# Altium project Transponder.PrjPcb
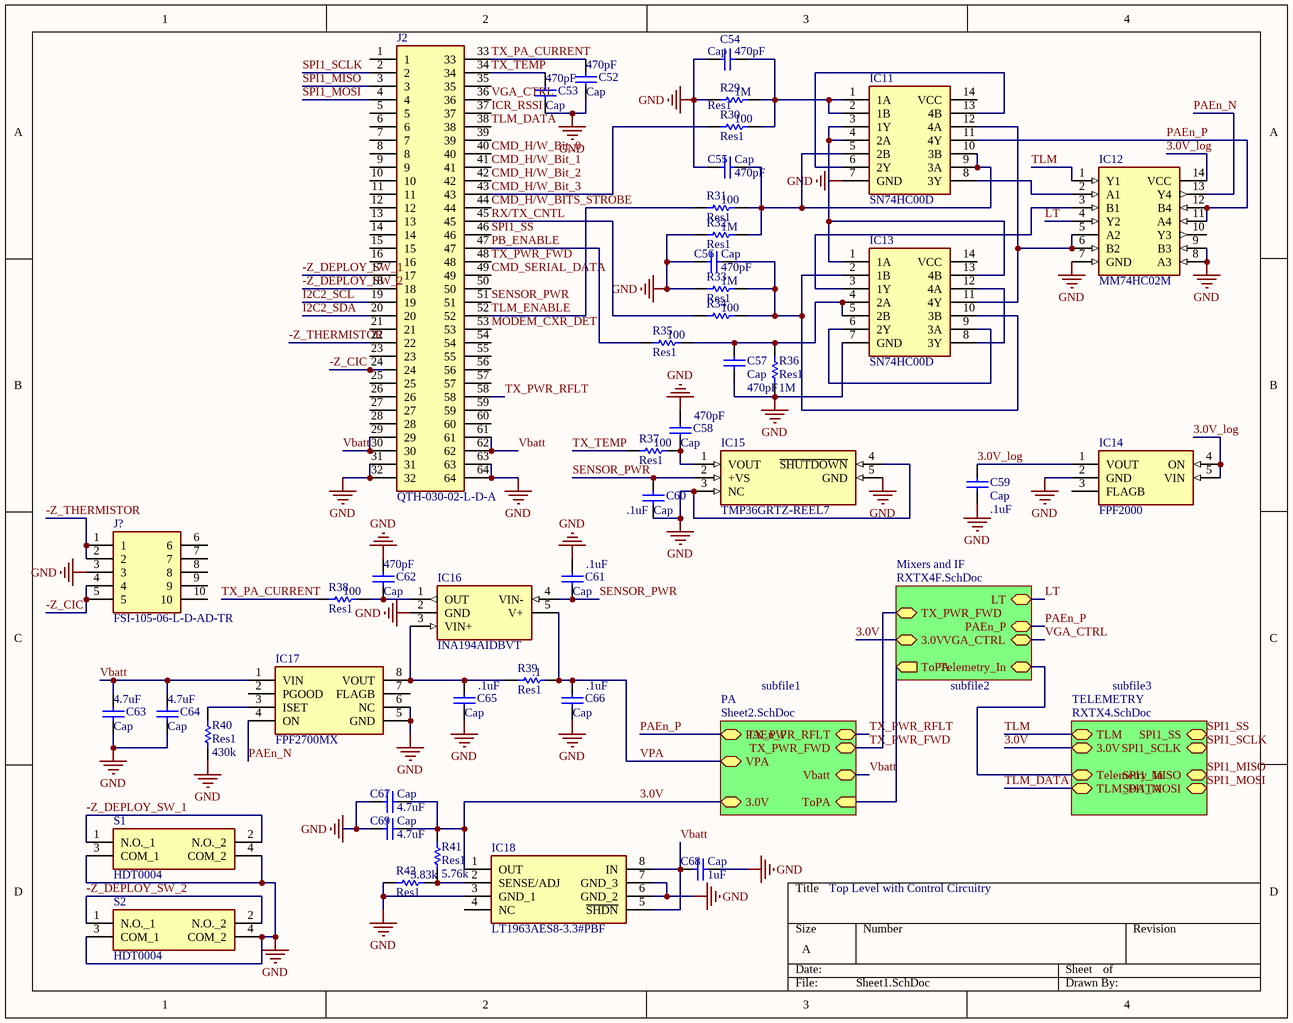
[diagram p0: Sheet1.SchDoc]
4 sheets, 303 parts. Net scope: hierarchical (ports join the sheet entries above them; power ports are global).
Board file: PCB1.PcbDoc
Sheets:
  Sheet1.SchDoc
    PA = Sheet2.SchDoc
    Mixers and IF = RXTX4F.SchDoc
    TELEMETRY = RXTX4.SchDoc

## Sheet Sheet1.SchDoc
size A

### Parts
C52  Cap  value 470pF  [0603]
C53  Cap  value 470pF  [0603]
C54  Cap  value 470pF  [0603]
C55  Cap  value 470pF  [0603]
C56  Cap  value 470pF  [0603]
C57  Cap  value 470pF  [0603]
C58  Cap  value 470pF  [0603]
C59  Cap  value .1uF  [0603]
C60  Cap  value .1uF  [0603]
C61  Cap  value .1uF  [0603]
C62  Cap  value 470pF  [0603]
C63  Cap  value 4.7uF  [0603]
C64  Cap  value 4.7uF  [0603]
C65  Cap  value .1uF  [0603]
C66  Cap  value .1uF  [0603]
C67  Cap  value 4.7uF  [0603]
C68  Cap  value 1uF  [0603]
C69  Cap  value 4.7uF  [0603]
IC11  SN74HC00D  [SOIC127P600X175-14N]
IC12  MM74HC02M  [SOIC127P600X175-14N]
IC13  SN74HC00D  [SOIC127P600X175-14N]
IC14  FPF2000  [SOT65P210X110-5N]
IC15  TMP36GRTZ-REEL7  [SOT95P280X145-5N]
IC16  INA194AIDBVT  [SOT95P280X145-5N]
IC17  FPF2700MX  [SOIC127P600X175-8N]
IC18  LT1963AES8-3.3#PBF  [SOIC127P599X175-8N]
J2  QTH-030-02-L-D-A  [QTH03002LDA]
J?  FSI-105-06-L-D-AD-TR  [FSI10506LDADTR]
R29  Res1  value 1M  [0603]
R30  Res1  value 100  [0603]
R31  Res1  value 100  [0603]
R32  Res1  value 1M  [0603]
R33  Res1  value 1M  [0603]
R34  value 100  [0603]  (hidden comment: Res1)
R35  Res1  value 100  [0603]
R36  Res1  value 1M  [0603]
R37  Res1  value 100  [0603]
R38  Res1  value 100  [0603]
R39  Res1  value .1  [0603]
R40  Res1  value 430k  [0603]
R41  Res1  value 5.76k  [0603]
R42  Res1  value 3.83k  [0603]
S1  HDT0004  [HDT0004]
S2  HDT0004  [HDT0004]

### Sub-sheets
Mixers and IF = RXTX4F.SchDoc: TX_PWR_FWD (bidir), 3.0V (bidir), ToPA (out), LT (bidir), PAEn_P (bidir), VGA_CTRL (bidir), Telemetry_In (bidir)
PA = Sheet2.SchDoc: PAEn_P (bidir), VPA (bidir), 3.0V (bidir), TX_PWR_RFLT (bidir), TX_PWR_FWD (bidir), Vbatt (bidir), ToPA (in)
TELEMETRY = RXTX4.SchDoc: TLM (bidir), 3.0V (bidir), Telemetry_In (bidir), TLM_DATA (bidir), SPI1_SS (bidir), SPI1_SCLK (bidir), SPI1_MISO (bidir), SPI1_MOSI (bidir)

### Nets
GND: C52.2 C53.2 C54.1 C55.1 C56.1 C57.2 C58.1 C59.2 C60.2 C61.1 C62.1 C63.2 C64.2 C65.2 C66.2 C67.1 C68.2 C69.1 IC11.7(GND) IC12.7(GND) IC12.8(A3) IC12.9(B3) IC13.7(GND) IC14.2(GND) IC15.3(NC) IC15.4(~{SHUTDOWN}) IC15.5(GND) IC16.2(GND) IC17.5(GND) IC17.6(NC) IC18.3(GND_1) IC18.6(GND_2) IC18.7(GND_3) J2.31 J2.32 J2.63 J2.64 J?.3 R29.1 R32.1 R33.1 R36.2 R40.2 R42.1 S1.3(COM_1) S1.4(COM_2) S2.3(COM_1) S2.4(COM_2)
3.0V: C67.2 C69.2 IC18.1(OUT) R41.1 ; sheet PA/3.0V, sheet Mixers and IF/3.0V, sheet TELEMETRY/3.0V
3.0V_log: C59.1 IC12.14(VCC) IC14.1(VOUT) IC14.4(ON) IC14.5(VIN)
-Z_CIC: J2.24 J?.4 J?.5
-Z_DEPLOY_SW_1: J2.17 S1.1(N.O._1) S1.2(N.O._2)
-Z_DEPLOY_SW_2: J2.18 S2.1(N.O._1) S2.2(N.O._2)
-Z_THERMISTOR: J2.22 J?.1 J?.2
CMD_H/W_Bit_0: J2.40
CMD_H/W_Bit_1: J2.41
CMD_H/W_Bit_2: J2.42
CMD_H/W_Bit_3: J2.43 R30.1
CMD_H/W_BITS_STROBE: J2.44
CMD_SERIAL_DATA: J2.49
I2C2_SCL: J2.19
I2C2_SDA: J2.20
ICR_RSSI: J2.37
LT: IC12.4(Y2) ; sheet Mixers and IF/LT
MODEM_CXR_DET: J2.53
PAEn_N: IC12.13(Y4) IC17.4(ON)
PAEn_P: IC11.11(4Y) IC12.11(A4) IC12.12(B4) ; sheet PA/PAEn_P, sheet Mixers and IF/PAEn_P
PB_ENABLE: J2.47 R35.1
RX/TX_CNTL: J2.45 R34.1
SENSOR_PWR: C60.1 C61.2 IC15.2(+VS) IC16.4(VIN-) J2.51
SPI1_MISO: J2.3 ; sheet TELEMETRY/SPI1_MISO
SPI1_MOSI: J2.4 ; sheet TELEMETRY/SPI1_MOSI
SPI1_SCLK: J2.2 ; sheet TELEMETRY/SPI1_SCLK
SPI1_SS: J2.46 ; sheet TELEMETRY/SPI1_SS
TLM: IC12.1(Y1) ; sheet TELEMETRY/TLM
TLM_DATA: J2.38 ; sheet TELEMETRY/TLM_DATA
TLM_ENABLE: J2.52 R31.1
TX_PA_CURRENT: C52.1 J2.33 R38.1
TX_PWR_FWD: J2.48 ; sheet PA/TX_PWR_FWD, sheet Mixers and IF/TX_PWR_FWD
TX_PWR_RFLT: J2.58 ; sheet PA/TX_PWR_RFLT
TX_TEMP: C53.1 J2.34 R37.1
Vbatt: C63.1 C64.1 C68.1 IC17.1(VIN) IC18.5(~{SHDN}) IC18.8(IN) J2.29 J2.30 J2.61 J2.62 ; sheet PA/Vbatt
VGA_CTRL: J2.36 ; sheet Mixers and IF/VGA_CTRL
VPA: C66.1 IC16.5(V+) R39.2 ; sheet PA/VPA
NetC32_2: sheet PA/ToPA, sheet Mixers and IF/ToPA
NetC54_2: C54.2 IC11.1(1A) IC11.2(1B) R29.2 R30.2
NetC55_2: C55.2 IC11.5(2B) IC11.9(3A) IC11.10(3B) R31.2 R32.2
NetC56_2: C56.2 IC13.2(1B) IC13.10(3B) R33.2 R34.2
NetC57_1: C57.1 IC13.4(2A) IC13.5(2B) R35.2 R36.1
NetC58_2: C58.2 IC15.1(VOUT) R37.2
NetC62_2: C62.2 IC16.1(OUT) R38.2
NetC65_1: C65.1 IC16.3(VIN+) IC17.8(VOUT) R39.1
NetC212_2: sheet Mixers and IF/Telemetry_In, sheet TELEMETRY/Telemetry_In
NetIC11_3: IC11.3(1Y) IC11.4(2A) IC13.1(1A) IC13.13(4B)
NetIC11_6: IC11.6(2Y) IC11.13(4B)
NetIC11_8: IC11.8(3Y) IC12.2(A1)
NetIC11_12: IC11.12(4A) IC12.5(A2) IC12.6(B2) IC13.11(4Y)
NetIC12_3: IC12.3(B1) IC13.3(1Y)
NetIC13_6: IC13.6(2Y) IC13.9(3A)
NetIC13_8: IC13.8(3Y) IC13.12(4A)
NetIC17_3: IC17.3(ISET) R40.1
NetIC18_2: IC18.2(SENSE/ADJ) R41.2 R42.2

Not connected (* = marked no-connect by the designer): IC11 14(VCC); IC12 10(Y3); IC13 14(VCC); IC14 3(FLAGB); IC17 2(PGOOD) 7(FLAGB); IC18 4(NC); J2 1 5 6 7 8 9 10 11 12 13 14 15 16 21 23 25 26 27 28 35 39 50 54 55 56 57 59 60; J? 6 7 8 9 10

### Notes on the sheet
- subfile1
- subfile2
- subfile3
- Top Level with Control Circuitry

### Library data of the parts
C52-C69 = Cap: Capacitor; Published: 8-Jun-2000; LatestRevisionDate: 17-Jul-2002; LatestRevisionNote: Re-released for DXP Platform.; PackageReference: RAD-0.3; Publisher: Altium Limited; PackageDescription: Radial Cap, Thru-Hole; 2 Leads; 0.3 in Pin Spacing
IC11 IC13 = SN74HC00D: Integrated Circuit; Manufacturer_Name: Texas Instruments; Datasheet Link: http://www.ti.com/lit/gpn/sn74hc00; Height: 1.75mm; Manufacturer_Part_Number: SN74HC00D; Mouser Part Number: 595-SN74HC00D; Mouser Price/Stock: https://www.mouser.com/Search/Refine.aspx?Keyword=595-SN74HC00D; RS Part Number: 0526234; RS Price/Stock: http://uk.rs-online.com/web/p/products/0526234
IC12 = MM74HC02M: Integrated Circuit; Manufacturer_Name: ON Semiconductor; Datasheet Link: https://www.fairchildsemi.com/datasheets/MM/MM74HC02.pdf; Height: 1.75mm; Manufacturer_Part_Number: MM74HC02M; Mouser Part Number: 512-MM74HC02M; Mouser Price/Stock: https://www.mouser.com/Search/Refine.aspx?Keyword=512-MM74HC02M; RS Part Number: 7613555P; RS Price/Stock: http://uk.rs-online.com/web/p/products/7613555P
IC14 = FPF2000: Integrated Circuit; Manufacturer_Name: ON Semiconductor; Datasheet Link: https://www.onsemi.com/pub/Collateral/FPF2001-D.pdf; Height: 1.1mm; Manufacturer_Part_Number: FPF2000; Mouser Part Number: 512-FPF2000; Mouser Price/Stock: https://www.mouser.com/Search/Refine.aspx?Keyword=512-FPF2000; RS Part Number: 6709942P; RS Price/Stock: http://uk.rs-online.com/web/p/products/6709942P
IC15 = TMP36GRTZ-REEL7: Integrated Circuit; Manufacturer_Name: Analog Devices; Datasheet Link: http://componentsearchengine.com/Datasheets/3/TMP36GRTZ-REEL7.pdf; Height: 1.45mm; Manufacturer_Part_Number: TMP36GRTZ-REEL7; Mouser Part Number: 584-TMP36GRTZ-R7; Mouser Price/Stock: https://www.mouser.com/Search/Refine.aspx?Keyword=584-TMP36GRTZ-R7; RS Part Number: 8099367P; RS Price/Stock: http://uk.rs-online.com/web/p/products/8099367P
IC16 = INA194AIDBVT: Integrated Circuit; Manufacturer_Name: Texas Instruments; Datasheet Link: http://www.ti.com/lit/ds/symlink/ina194.pdf; Height: 1.45mm; Manufacturer_Part_Number: INA194AIDBVT; Mouser Part Number: 595-INA194AIDBVT; Mouser Price/Stock: https://www.mouser.com/Search/Refine.aspx?Keyword=595-INA194AIDBVT; RS Part Number: 5457625P; RS Price/Stock: http://uk.rs-online.com/web/p/products/5457625P
IC17 = FPF2700MX: Integrated Circuit; Manufacturer_Name: ON Semiconductor; Datasheet Link: https://www.onsemi.com/pub/Collateral/FPF2702-D.pdf; Height: 1.75mm; Manufacturer_Part_Number: FPF2700MX; Mouser Part Number: 512-FPF2700MX; Mouser Price/Stock: https://www.mouser.com/Search/Refine.aspx?Keyword=512-FPF2700MX; RS Part Number: 8088966P; RS Price/Stock: http://uk.rs-online.com/web/p/products/8088966P
IC18 = LT1963AES8-3.3#PBF: Integrated Circuit; Manufacturer_Name: Linear Technology; Datasheet Link: http://www.linear.com/docs/3709; Height: 1.752mm; Manufacturer_Part_Number: LT1963AES8-3.3#PBF; Mouser Part Number: 584-1963AES8-3.3PBF; Mouser Price/Stock: https://www.mouser.com/Search/Refine.aspx?Keyword=584-1963AES8-3.3PBF; RS Part Number: 7618550P; RS Price/Stock: http://uk.rs-online.com/web/p/products/7618550P
J2 = QTH-030-02-L-D-A: Connector; Manufacturer_Name: SAMTEC; Datasheet Link: http://suddendocs.samtec.com/prints/qth-xxx-xx-x-d-xxx-mkt.pdf; Height: 7.064mm; Manufacturer_Part_Number: QTH-030-02-L-D-A; Mouser Part Number: 200-QTH03002LDA; Mouser Price/Stock: https://www.mouser.com/Search/Refine.aspx?Keyword=200-QTH03002LDA; RS Part Number: 7678748P; RS Price/Stock: http://uk.rs-online.com/web/p/products/7678748P
J? = FSI-105-06-L-D-AD-TR: Connector; Manufacturer_Name: SAMTEC; Datasheet Link: http://suddendocs.samtec.com/prints/fsi-1xx-xx-xxx-d-x-xx-xx-mkt.pdf; Height: 7.4mm; Manufacturer_Part_Number: FSI-105-06-L-D-AD-TR
R29-R42 = Res1: Resistor; Published: 8-Jun-2000; LatestRevisionDate: 17-Jul-2002; LatestRevisionNote: Re-released for DXP Platform.; PackageReference: AXIAL-0.3; Publisher: Altium Limited; PackageDescription: Axial Device, Thru-Hole; 2 Leads; 0.3 in Pin Spacing
S1 S2 = HDT0004: Switch; Manufacturer_Name: C & K COMPONENTS; Datasheet Link: https://www.ckswitches.com/media/1307/hdt.pdf; Height: 3mm; Manufacturer_Part_Number: HDT0004; Mouser Part Number: 611-HDT0004; Mouser Price/Stock: https://www.mouser.com/Search/Refine.aspx?Keyword=611-HDT0004; RS Part Number: 7931608P; RS Price/Stock: http://uk.rs-online.com/web/p/products/7931608P

## Sheet Sheet2.SchDoc
size A
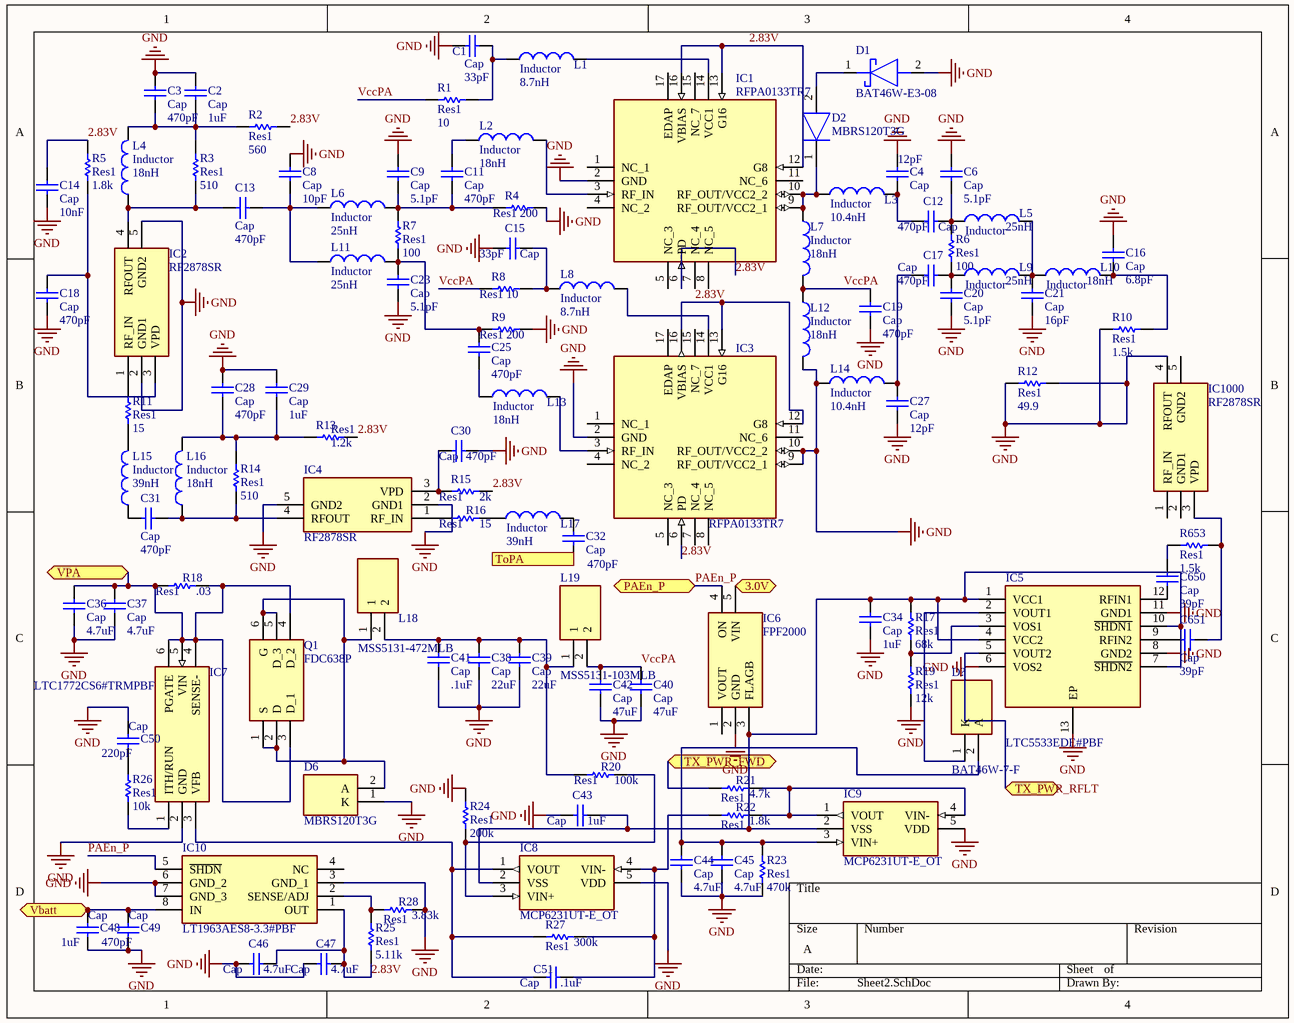
[diagram p1: Sheet2.SchDoc]

### Parts
C1  Cap  value 33pF  [0603]
C2  Cap  value 1uF  [0603]
C3  Cap  value 470pF  [0603]
C4  Cap  value 12pF  [0603]
C6  Cap  value 5.1pF  [0603]
C8  Cap  value 10pF  [0603]
C9  Cap  value 5.1pF  [0603]
C11  Cap  value 470pF  [0603]
C12  Cap  value 470pF  [0603]
C13  Cap  value 470pF  [0603]
C14  Cap  value 10nF  [0603]
C15  Cap  value 33pF  [0603]
C16  Cap  value 6.8pF  [0603]
C17  Cap  value 470pF  [0603]
C18  Cap  value 470pF  [0603]
C19  Cap  value 470pF  [0603]
C20  Cap  value 5.1pF  [0603]
C21  Cap  value 16pF  [0603]
C23  Cap  value 5.1pF  [0603]
C25  Cap  value 470pF  [0603]
C27  Cap  value 12pF  [0603]
C28  Cap  value 470pF  [0603]
C29  Cap  value 1uF  [0603]
C30  Cap  value 470pF  [0603]
C31  Cap  value 470pF  [0603]
C32  Cap  value 470pF  [0603]
C34  Cap  value 1uF  [0603]
C36  Cap  value 4.7uF  [0603]
C37  Cap  value 4.7uF  [0603]
C38  Cap  value 22uF  [0603]
C39  Cap  value 22uF  [0603]
C40  Cap  value 47uF  [0603]
C41  Cap  value .1uF  [0603]
C42  Cap  value 47uF  [0603]
C43  Cap  value 1uF  [0603]
C44  Cap  value 4.7uF  [0603]
C45  Cap  value 4.7uF  [0603]
C46  Cap  value 4.7uF  [0603]
C47  Cap  value 4.7uF  [0603]
C48  Cap  value 1uF  [0603]
C49  Cap  value 470pF  [0603]
C50  Cap  value 220pF  [0603]
C51  Cap  value .1uF  [0603]
C650  Cap  value 39pF  [0603]
C651  Cap  value 39pF  [0603]
D1  BAT46W-E3-08  [SOD3716X135N]
D2  MBRS120T3G  [DIOM5436X247N]
D6  MBRS120T3G  [DIOM5436X247N]
D?  BAT46W-7-F  [SOD3716X145N]
IC1  RFPA0133TR7  [QFN50P300X300X86-17N-D]
IC2  RF2878SR  [SOT95P280X159-5N]
IC3  RFPA0133TR7  [QFN50P300X300X86-17N-D]
IC4  RF2878SR  [SOT95P280X159-5N]
IC5  LTC5533EDE#PBF  [SON50P300X400X85-13N-D]
IC6  FPF2000  [SOT65P210X110-5N]
IC7  LTC1772CS6#TRMPBF  [SOT95P280X100-6N]
IC8  MCP6231UT-E_OT  [SOT95P270X145-5N]
IC9  MCP6231UT-E_OT  [SOT95P270X145-5N]
IC10  LT1963AES8-3.3#PBF  [SOIC127P599X175-8N]
IC1000  RF2878SR  [SOT95P280X159-5N]
L1  Inductor  value 8.7nH  [0603]
L2  Inductor  value 18nH  [0603]
L3  Inductor  value 10.4nH  [0603]
L4  Inductor  value 18nH  [0603]
L5  Inductor  value 25nH  [0603]
L6  Inductor  value 25nH  [0603]
L7  Inductor  value 18nH  [0603]
L8  Inductor  value 8.7nH  [0603]
L9  Inductor  value 25nH  [0603]
L10  Inductor  value 18nH  [0603]
L11  Inductor  value 25nH  [0603]
L12  Inductor  value 18nH  [0603]
L13  Inductor  value 18nH  [0603]
L14  Inductor  value 10.4nH  [0603]
L15  Inductor  value 39nH  [0603]
L16  Inductor  value 18nH  [0603]
L17  Inductor  value 39nH  [0603]
L18  MSS5131-472MLB  [MSS5131]
L19  MSS5131-103MLB  [MSS5131]
Q1  FDC638P  [SOT95P280X110-6N]
R1  Res1  value 10  [0603]
R2  Res1  value 560  [0603]
R3  Res1  value 510  [0603]
R4  Res1  value 200  [0603]
R5  Res1  value 1.8k  [0603]
R6  Res1  value 100  [0603]
R7  Res1  value 100  [0603]
R8  Res1  value 10  [0603]
R9  Res1  value 200  [0603]
R10  Res1  value 1.5k  [0603]
R11  Res1  value 15  [0603]
R12  Res1  value 49.9  [0603]
R13  Res1  value 1.2k  [0603]
R14  Res1  value 510  [0603]
R15  Res1  value 2k  [0603]
R16  Res1  value 15  [0603]
R17  Res1  value 68k  [0603]
R18  Res1  value .03  [0603]
R19  Res1  value 12k  [0603]
R20  Res1  value 100k  [0603]
R21  Res1  value 4.7k  [0603]
R22  Res1  value 1.8k  [0603]
R23  Res1  value 470k  [0603]
R24  Res1  value 200k  [0603]
R25  Res1  value 5.11k  [0603]
R26  Res1  value 10k  [0603]
R27  Res1  value 300k  [0603]
R28  Res1  value 3.83k  [0603]
R653  Res1  value 1.5k  [0603]

### Ports
3.0V (bidir), PAEn_P (bidir), ToPA (in), TX_PWR_FWD (bidir), TX_PWR_RFLT (bidir), Vbatt (bidir), VPA (bidir)

### Nets
GND: C1.1 C2.1 C3.1 C4.1 C6.1 C8.1 C9.1 C14.2 C15.1 C16.1 C18.2 C19.2 C20.2 C21.2 C23.2 C27.2 C28.1 C29.1 C30.2 C34.2 C36.2 C37.2 C38.2 C39.2 C40.2 C41.2 C42.2 C43.1 C44.2 C45.2 C46.2 C47.2 C48.2 C49.2 C50.1 D1.2(A) D6.1(K) IC1.2(GND) IC2.2(GND1) IC2.5(GND2) IC3.2(GND) IC3.9(RF_OUT/VCC2_1) IC3.10(RF_OUT/VCC2_2) IC4.2(GND1) IC4.5(GND2) IC5.6(VOS2) IC5.8(GND2) IC5.11(GND1) IC5.13(EP) IC6.2(GND) IC7.2(GND) IC8.5(VDD) IC9.5(VDD) IC10.3(GND_1) IC10.6(GND_2) IC10.7(GND_3) IC1000.4(RFOUT) L12.2 L14.1 R4.2 R9.2 R10.1 R12.1 R12.2 R19.2 R23.2 R24.1 R28.1
2.83V: C14.1 C46.1 C47.1 IC1.6(PD) IC1.12(G8) IC1.13(G16) IC1.16(VBIAS) IC3.6(PD) IC3.12(G8) IC3.13(G16) IC3.16(VBIAS) IC10.1(OUT) R2.2 R5.1 R13.1 R15.2 R25.2
3.0V: IC6.5(VIN) ; port 3.0V
PAEn_P: IC6.4(ON) IC10.5(~{SHDN}) ; port PAEn_P
TX_PWR_FWD: R21.2 ; port TX_PWR_FWD
TX_PWR_RFLT: IC5.5(VOUT2) ; port TX_PWR_RFLT
Vbatt: C48.1 C49.1 IC10.8(IN) ; port Vbatt
VccPA: C19.1 C40.1 C42.1 L7.2 L12.1 L19.2 R1.1 R8.1
VPA: C36.1 C37.1 IC7.4(SENSE-) IC7.5(VIN) IC7.6(PGATE) Q1.3(D_1) Q1.4(D_2) R18.1 R18.2 ; port VPA
NetC1_2: C1.2 L1.1 R1.2
NetC2_2: C2.2 C3.2 L4.2 R2.1 R3.1
NetC4_2: C4.2 C12.2 L3.2
NetC6_2: C6.2 C12.1 L5.1 R6.1
NetC8_2: C8.2 C13.2 L6.1 L11.1
NetC9_2: C9.2 C11.2 L6.2 R4.1 R7.1
NetC11_1: C11.1 L2.1
NetC13_1: C13.1 IC2.4(RFOUT) L4.1 R3.2
NetC15_2: C15.2 L8.1 R8.2
NetC16_2: C16.2 L10.2 R10.2
NetC17_1: C17.1 C20.1 L9.1 R6.2
NetC17_2: C17.2 C27.1 L14.2
NetC18_1: C18.1 IC2.3(VPD) R5.2
NetC21_1: C21.1 L5.2 L9.2 L10.1
NetC23_1: C23.1 C25.1 L11.2 R7.2 R9.1
NetC25_2: C25.2 L13.1
NetC28_2: C28.2 C29.2 L16.2 R13.2 R14.1
NetC30_1: C30.1 IC4.3(VPD) R15.1
NetC31_1: C31.1 L15.1
NetC31_2: C31.2 IC4.4(RFOUT) L16.1 R14.2
NetC32_1: C32.1 L17.2
NetC32_2: C32.2 ; port ToPA
NetC34_1: C34.1 C43.2 IC5.1(VCC1) IC5.4(VCC2) IC5.7(~{SHDN2}) IC5.10(~{SHDN1}) IC6.3(FLAGB) IC8.2(VSS) IC9.2(VSS) R17.1
NetC38_1: C38.1 C39.1 C41.1 L18.2 L19.1 R20.1
NetC44_1: C44.1 C45.1 D?.2(A) IC9.3(VIN+) R23.1
NetC50_2: C50.2 R26.1
NetC51_1: C51.1 IC7.3(VFB) IC8.1(VOUT) R27.2
NetC51_2: C51.2 IC8.4(VIN-) R22.2 R27.1
NetC650_1: C650.1 R653.1
NetC650_2: C650.2 IC5.12(RFIN1)
NetC651_1: C651.1 IC1000.3(VPD) R653.2
NetC651_2: C651.2 IC5.9(RFIN2)
NetD1_1: D1.1(K) D2.2(A)
NetD2_1: D2.1(K) IC1.9(RF_OUT/VCC2_1) IC1.10(RF_OUT/VCC2_2) L3.1 L7.1
NetD6_2: D6.2(A) L18.1 Q1.1(S) Q1.2(D) Q1.5(D_3) Q1.6(G)
NetD?_1: D?.1(K) IC5.2(VOUT1)
NetIC1_3: IC1.3(RF_IN) L2.2
NetIC1_14: IC1.14(VCC1) L1.2
NetIC2_1: IC2.1(RF_IN) R11.1
NetIC3_3: IC3.3(RF_IN) L13.2
NetIC3_14: IC3.14(VCC1) L8.2
NetIC4_1: IC4.1(RF_IN) R16.1
NetIC5_3: IC5.3(VOS1) R17.2 R19.1
NetIC7_1: IC7.1(ITH/RUN) R26.2
NetIC8_3: IC8.3(VIN+) R20.2 R24.2
NetIC9_1: IC9.1(VOUT) IC9.4(VIN-) R21.1 R22.1
NetIC10_2: IC10.2(SENSE/ADJ) R25.1 R28.2
NetL15_2: L15.2 R11.2
NetL17_1: L17.1 R16.2

Not connected (* = marked no-connect by the designer): IC1 1(NC_1) 4(NC_2) 5(NC_3) 7(NC_4) 8(NC_5) 11(NC_6) 15(NC_7) 17(EDAP); IC3 1(NC_1) 4(NC_2) 5(NC_3) 7(NC_4) 8(NC_5) 11(NC_6) 15(NC_7) 17(EDAP); IC6 1(VOUT); IC10 4(NC); IC1000 1(RF_IN) 2(GND1) 5(GND2)

### Library data of the parts
C1-C4 C6 C8 C9 C11-C21 C23 C25 C27-C32 C34 C36-C51 C650 C651 = Cap: Capacitor; Published: 8-Jun-2000; LatestRevisionDate: 17-Jul-2002; LatestRevisionNote: Re-released for DXP Platform.; PackageReference: RAD-0.3; Publisher: Altium Limited; PackageDescription: Radial Cap, Thru-Hole; 2 Leads; 0.3 in Pin Spacing
D1 = BAT46W-E3-08: Schottky Diode; Manufacturer_Name: Vishay; Datasheet Link: https://www.vishay.com/docs/85663/bat46wv.pdf; Height: 1.35mm; Manufacturer_Part_Number: BAT46W-E3-08; Mouser Part Number: 78-BAT46W-E3-08; Mouser Price/Stock: https://www.mouser.co.uk/ProductDetail/Vishay-Semiconductors/BAT46W-E3-08?qs=KP8Io%2FXyE5QAjvoG5XlHWA%3D%3D; RS Part Number: 7104493P; RS Price/Stock: http://uk.rs-online.com/web/p/products/7104493P
D2 D6 = MBRS120T3G: Diode; Manufacturer_Name: ON Semiconductor; Allied_Number: 70339713; Datasheet Link: http://www.onsemi.com/pub/Collateral/MBRS120T3-D.PDF; Height: 2.47mm; Manufacturer_Part_Number: MBRS120T3G; Mouser Part Number: 863-MBRS120T3G; RS Part Number: 5452068P; RS Price/Stock: http://uk.rs-online.com/web/p/products/5452068P; Allied Price/Stock: http://www.alliedelec.com/on-semiconductor-mbrs120t3g/70339713/
  D2: Mouser Price/Stock: https://www.mouser.co.uk/ProductDetail/ON-Semiconductor/MBRS120T3G?qs=3JMERSakebrTp9%2FFDiKL2w%3D%3D
  D6: Mouser Price/Stock: https://www.mouser.com/Search/Refine.aspx?Keyword=863-MBRS120T3G
D? = BAT46W-7-F: Diode; Manufacturer_Name: Diodes Inc.; Allied_Number: 71028110; Datasheet Link: https://componentsearchengine.com/Datasheets/2/BAT46W-7-F.pdf; Height: 1.45mm; Manufacturer_Part_Number: BAT46W-7-F; Mouser Part Number: 621-BAT46W-7-F; Mouser Price/Stock: https://www.mouser.com/Search/Refine.aspx?Keyword=621-BAT46W-7-F; RS Part Number: 7513373P; RS Price/Stock: http://uk.rs-online.com/web/p/products/7513373P; Allied Price/Stock: https://www.alliedelec.com/diodes-inc-bat46w-7-f/71028110/
IC1 IC3 = RFPA0133TR7: Integrated Circuit; Manufacturer_Name: Qorvo; Datasheet Link: http://www.qorvo.com/products/d/da000936; Height: 0.855mm; Manufacturer_Part_Number: RFPA0133TR7; Mouser Part Number: 772-RFPA0133; Mouser Price/Stock: https://www.mouser.com/Search/Refine.aspx?Keyword=772-RFPA0133
IC2 IC4 IC1000 = RF2878SR: Integrated Circuit; Manufacturer_Name: RFMD; Datasheet Link: https://datasheet.octopart.com/RF2878SR-RFMD-datasheet-17020116.pdf; Height: 1.59mm; Manufacturer_Part_Number: RF2878SR
IC5 = LTC5533EDE#PBF: Integrated Circuit; Manufacturer_Name: Linear Technology; Datasheet Link: https://componentsearchengine.com/Datasheets/2/LTC5533EDE#PBF.pdf; Height: 0.85mm; Manufacturer_Part_Number: LTC5533EDE#PBF
IC6 = FPF2000: as IC14 on sheet Sheet1; Datasheet Link: https://www.onsemi.com/pub/Collateral/FPF2001-D.pdf; Height: 1.1mm; Manufacturer_Part_Number: FPF2000; Mouser Part Number: 512-FPF2000; Mouser Price/Stock: https://www.mouser.com/Search/Refine.aspx?Keyword=512-FPF2000; RS Part Number: 6709942P; RS Price/Stock: http://uk.rs-online.com/web/p/products/6709942P
IC7 = LTC1772CS6#TRMPBF: Integrated Circuit; Manufacturer_Name: Linear Technology; Datasheet Link: http://docs-emea.rs-online.com/webdocs/0ab8/0900766b80ab84d2.pdf; Height: 1mm; Manufacturer_Part_Number: LTC1772CS6#TRMPBF; Mouser Part Number: 584-LTC1772CS6TRMPBF; Mouser Price/Stock: https://www.mouser.com/Search/Refine.aspx?Keyword=584-LTC1772CS6TRMPBF; RS Part Number: 0411891; RS Price/Stock: http://uk.rs-online.com/web/p/products/0411891
IC8 IC9 = MCP6231UT-E_OT: Integrated Circuit; Manufacturer_Name: Microchip; Manufacturer_Part_Number: MCP6231UT-E/OT; Allied_Number: 70414221; Datasheet Link: http://ww1.microchip.com/downloads/en/DeviceDoc/21881e.pdf; Height: 1.45mm; Mouser Part Number: 579-MCP6231UT-E/OT; Mouser Price/Stock: https://www.mouser.com/Search/Refine.aspx?Keyword=579-MCP6231UT-E%2FOT; RS Part Number: 6674468; RS Price/Stock: https://uk.rs-online.com/web/p/products/6674468; Allied Price/Stock: http://www.alliedelec.com/microchip-technology-inc-mcp6231ut-e-ot/70414221/
IC10 = LT1963AES8-3.3#PBF: as IC18 on sheet Sheet1; Datasheet Link: http://www.linear.com/docs/3709; Height: 1.752mm; Manufacturer_Part_Number: LT1963AES8-3.3#PBF; Mouser Part Number: 584-1963AES8-3.3PBF; Mouser Price/Stock: https://www.mouser.com/Search/Refine.aspx?Keyword=584-1963AES8-3.3PBF; RS Part Number: 7618550P; RS Price/Stock: http://uk.rs-online.com/web/p/products/7618550P
L1-L17 = Inductor: Code_IEC: 1005; Published: 8-Jun-2000; LatestRevisionDate: 29-May-2009; LatestRevisionNote: IPC-7351 Footprint Added.; PackageReference: 0402-A; Publisher: Altium Limited; PackageDescription: Chip Inductor; Code_JEITA: 0402
L18 = MSS5131-472MLB: Inductor; Manufacturer_Name: COILCRAFT; Datasheet Link: http://www.coilcraft.com/pdfs/mss5131.pdf; Manufacturer_Part_Number: MSS5131-472MLB; Mouser Part Number: 994-MSS5131-472MLB; Mouser Price/Stock: https://www.mouser.com/Search/Refine.aspx?Keyword=994-MSS5131-472MLB
L19 = MSS5131-103MLB: Inductor; Manufacturer_Name: COILCRAFT; Datasheet Link: https://componentsearchengine.com/Datasheets/1/MSS5131-103MLB.pdf; Manufacturer_Part_Number: MSS5131-103MLB; Mouser Part Number: 994-MSS5131-103MLB; Mouser Price/Stock: https://www.mouser.com/Search/Refine.aspx?Keyword=994-MSS5131-103MLB
Q1 = FDC638P: Integrated Circuit; Manufacturer_Name: ON Semiconductor; Datasheet Link: http://docs-emea.rs-online.com/webdocs/10e2/0900766b810e24f1.pdf; Height: 1.1mm; Manufacturer_Part_Number: FDC638P; Mouser Part Number: 512-FDC638P; Mouser Price/Stock: https://www.mouser.com/Search/Refine.aspx?Keyword=512-FDC638P; RS Part Number: 7614413; RS Price/Stock: https://uk.rs-online.com/web/p/products/7614413
R1-R28 R653 = Res1: Resistor; Published: 8-Jun-2000; LatestRevisionDate: 17-Jul-2002; LatestRevisionNote: Re-released for DXP Platform.; PackageReference: AXIAL-0.3; Publisher: Altium Limited; PackageDescription: Axial Device, Thru-Hole; 2 Leads; 0.3 in Pin Spacing

## Sheet RXTX4F.SchDoc
size B
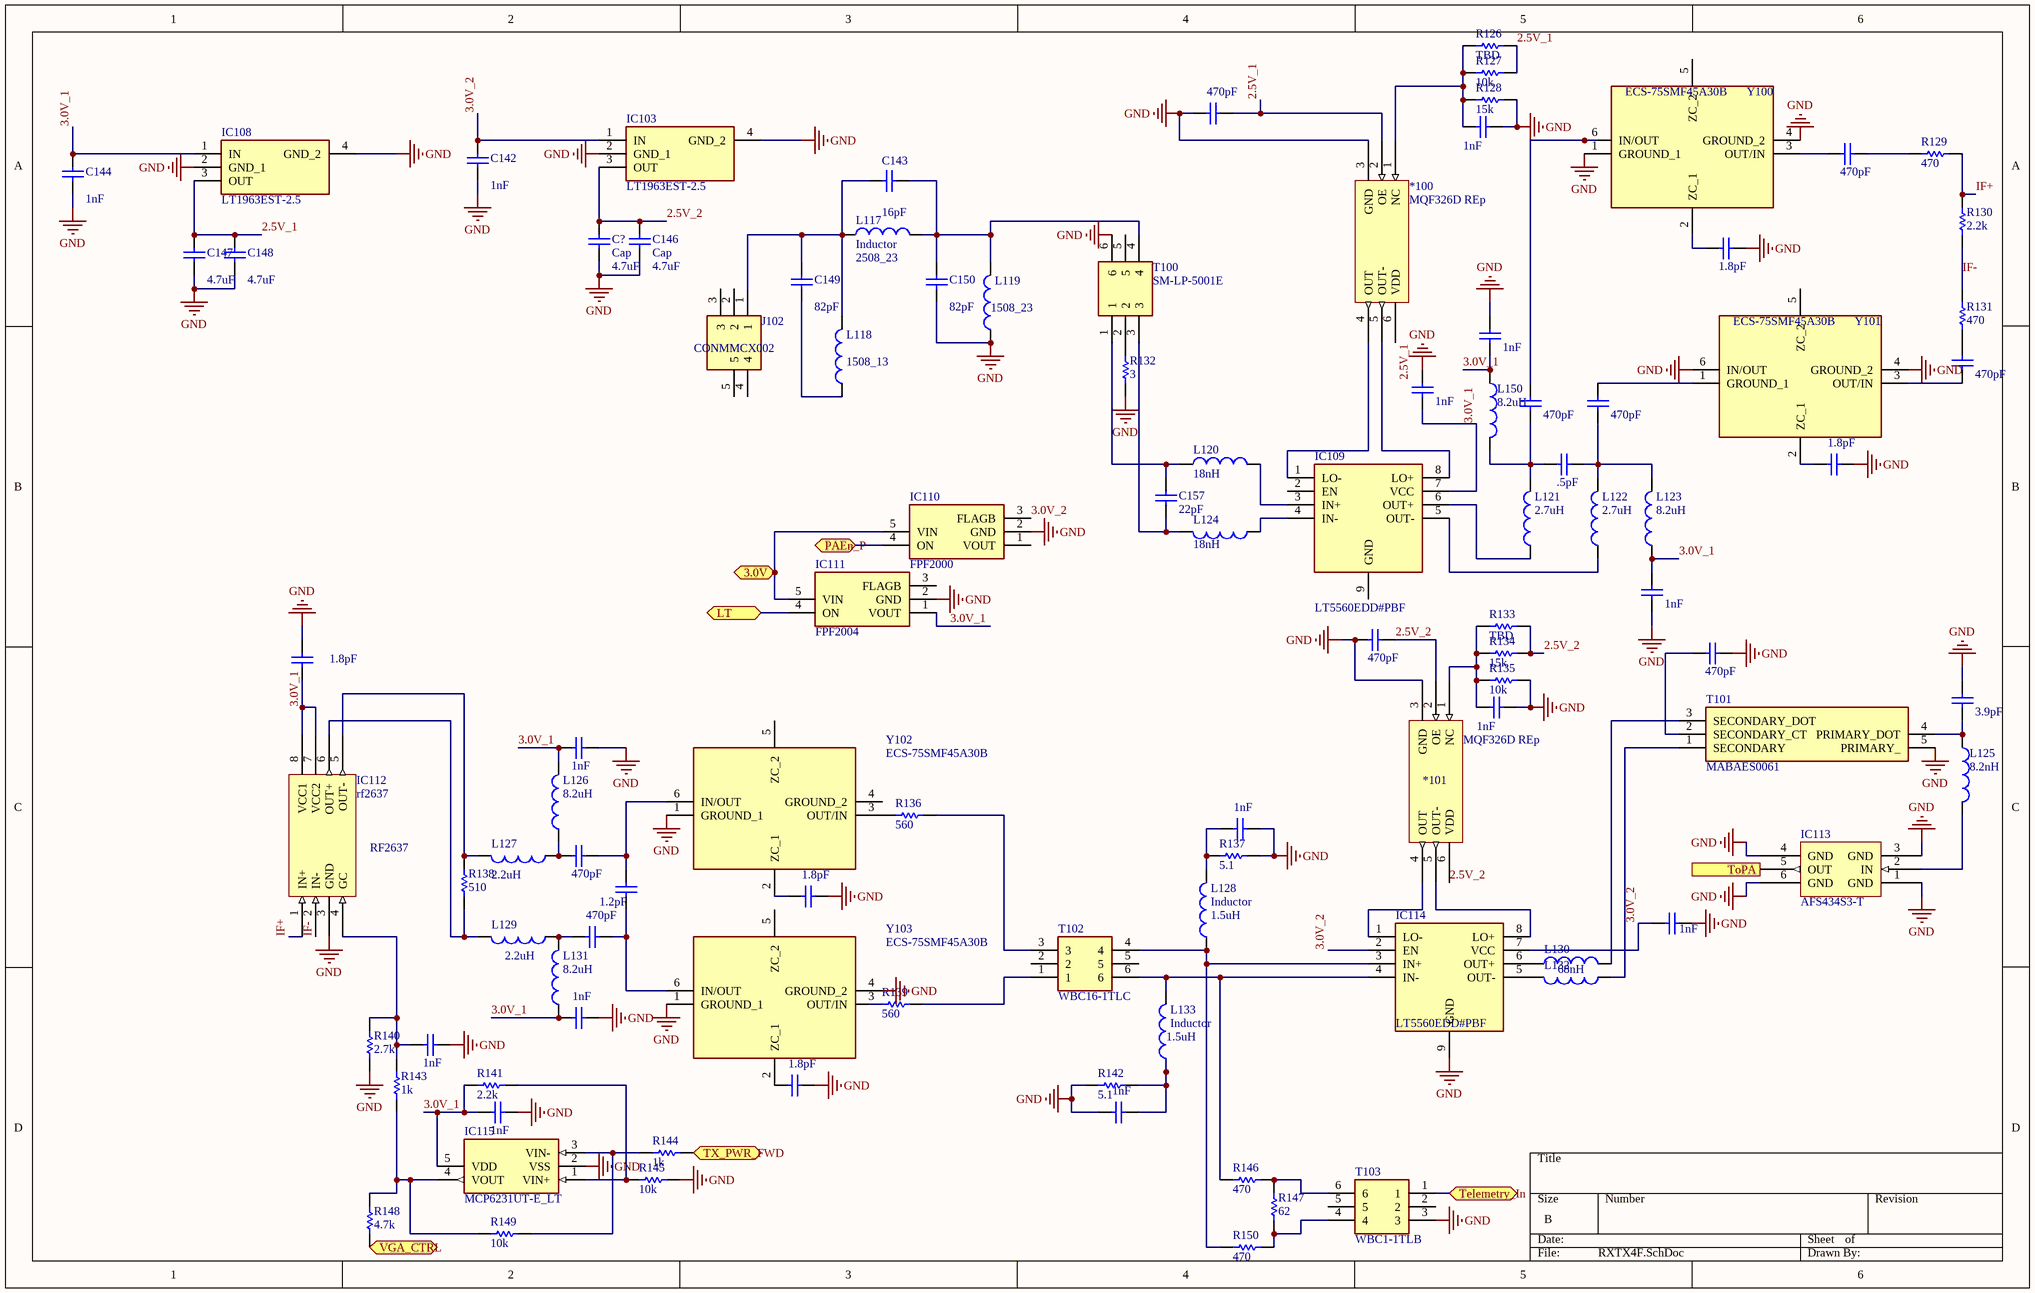
[diagram p2: RXTX4F.SchDoc]

### Parts
*100  MQF326D REp  [MQF326D]
*101  MQF326D REp  [MQF326D]
C139  value 470pF  [0603]  (hidden comment: Cap)
C140  value 1nF  [0603]  (hidden comment: Cap)
C141  value 470pF  [0603]  (hidden comment: Cap)
C142  value 1nF  [0603]  (hidden comment: Cap)
C143  value 16pF  [0603]  (hidden comment: Cap)
C144  value 1nF  [0603]  (hidden comment: Cap)
C145  value 1.8pF  [0603]  (hidden comment: Cap)
C146  Cap  value 4.7uF  [0603]
C147  value 4.7uF  [0603]  (hidden comment: Cap)
C148  value 4.7uF  [0603]  (hidden comment: Cap)
C149  value 82pF  [0603]  (hidden comment: Cap)
C150  value 82pF  [0603]  (hidden comment: Cap)
C151  value 470pF  [0603]  (hidden comment: Cap)
C152  value 1nF  [0603]  (hidden comment: Cap)
C153  value 470pF  [0603]  (hidden comment: Cap)
C154  value 470pF  [0603]  (hidden comment: Cap)
C155  value .5pF  [0603]  (hidden comment: Cap)
C156  value 1.8pF  [0603]  (hidden comment: Cap)
C157  value 22pF  [0603]  (hidden comment: Cap)
C158  value 1nF  [0603]  (hidden comment: Cap)
C159  value 470pF  [0603]  (hidden comment: Cap)
C160  value 470pF  [0603]  (hidden comment: Cap)
C161  value 1.8pF  [0603]  (hidden comment: Cap)
C162  value 1nF  [0603]  (hidden comment: Cap)
C163  value 3.9pF  [0603]  (hidden comment: Cap)
C164  value 1nF  [0603]  (hidden comment: Cap)
C165  value 1nF  [0603]  (hidden comment: Cap)
C166  value 470pF  [0603]  (hidden comment: Cap)
C167  value 1.8pF  [0603]  (hidden comment: Cap)
C168  value 1.2pF  [0603]  (hidden comment: Cap)
C169  value 1nF  [0603]  (hidden comment: Cap)
C170  value 470pF  [0603]  (hidden comment: Cap)
C171  value 1nF  [0603]  (hidden comment: Cap)
C172  value 1nF  [0603]  (hidden comment: Cap)
C173  value 1.8pF  [0603]  (hidden comment: Cap)
C174  value 1nF  [0603]  (hidden comment: Cap)
C175  value 1nF  [0603]  (hidden comment: Cap)
C199  value 1nF  [0603]  (hidden comment: Cap)
C?  Cap  value 4.7uF  [0603]
IC103  LT1963EST-2.5  [SOT230P700X180-4N]
IC108  LT1963EST-2.5  [SOT230P700X180-4N]
IC109  LT5560EDD#PBF  [SON50P300X300X80-9N-D]
IC110  FPF2000  [SOT65P210X110-5N]
IC111  FPF2004  [SOT65P210X110-5N]
IC112  rf2637  [RF2637]
IC113  AFS434S3-T  [AFS434S3]
IC114  LT5560EDD#PBF  [SON50P300X300X80-9N-D]
IC115  MCP6231UT-E_LT  [SOT65P210X110-5N]
J102  CONMMCX002  [CONMMCX002]
L117  Inductor  value 2508_23  [0603]
L118  value 1508_13  [0603]  (hidden comment: Inductor)
L119  value 1508_23  [0603]  (hidden comment: Inductor)
L120  value 18nH  [0603]  (hidden comment: Inductor)
L121  value 2.7uH  [0603]  (hidden comment: Inductor)
L122  value 2.7uH  [0603]  (hidden comment: Inductor)
L123  value 8.2uH  [0603]  (hidden comment: Inductor)
L124  value 18nH  [0603]  (hidden comment: Inductor)
L125  value 8.2nH  [0603]  (hidden comment: Inductor)
L126  value 8.2uH  [0603]  (hidden comment: Inductor)
L127  value 2.2uH  [0603]  (hidden comment: Inductor)
L128  Inductor  value 1.5uH  [0603]
L129  value 2.2uH  [0603]  (hidden comment: Inductor)
L130  value 68nH  [0603]  (hidden comment: Inductor)
L131  value 8.2uH  [0603]  (hidden comment: Inductor)
L132  Inductor  [0603]  (value not drawn)
L133  Inductor  value 1.5uH  [0603]
L150  value 8.2uH  [0603]  (hidden comment: Inductor)
R126  value TBD  [0603]  (hidden comment: Res1)
R127  value 10k  [0603]  (hidden comment: Res1)
R128  value 15k  [0603]  (hidden comment: Res1)
R129  value 470  [0603]  (hidden comment: Res1)
R130  value 2.2k  [0603]  (hidden comment: Res1)
R131  value 470  [0603]  (hidden comment: Res1)
R132  value 3  [0603]  (hidden comment: Res1)
R133  value TBD  [0603]  (hidden comment: Res1)
R134  value 15k  [0603]  (hidden comment: Res1)
R135  value 10k  [0603]  (hidden comment: Res1)
R136  value 560  [0603]  (hidden comment: Res1)
R137  value 5.1  [0603]  (hidden comment: Res1)
R138  value 510  [0603]  (hidden comment: Res1)
R139  value 560  [0603]  (hidden comment: Res1)
R140  value 2.7k  [0603]  (hidden comment: Res1)
R141  value 2.2k  [0603]  (hidden comment: Res1)
R142  value 5.1  [0603]  (hidden comment: Res1)
R143  value 1k  [0603]  (hidden comment: Res1)
R144  value 1k  [0603]  (hidden comment: Res1)
R145  value 10k  [0603]  (hidden comment: Res1)
R146  value 470  [0603]  (hidden comment: Res1)
R147  value 62  [0603]  (hidden comment: Res1)
R148  value 4.7k  [0603]  (hidden comment: Res1)
R149  value 10k  [0603]  (hidden comment: Res1)
R150  value 470  [0603]  (hidden comment: Res1)
T100  SM-LP-5001E  [SMLP5001E]
T101  MABAES0061  [MABAES0061]
T102  WBC16-1TLC  [WBC161TLC]
T103  WBC1-1TLB  [WBC11TLC]
Y100  ECS-75SMF45A30B  [ECS75SMF45A30B]
Y101  ECS-75SMF45A30B  [ECS75SMF45A30B]
Y102  ECS-75SMF45A30B  [ECS75SMF45A30B]
Y103  ECS-75SMF45A30B  [ECS75SMF45A30B]

### Ports
3.0V (bidir), LT (bidir), PAEn_P (bidir), Telemetry_In (bidir), ToPA (out), TX_PWR_FWD (bidir), VGA_CTRL (bidir)

### Nets
GND: *100.3(GND) *101.3(GND) C139.2 C140.1 C142.1 C144.1 C145.1 C146.1 C147.1 C148.1 C150.2 C152.1 C156.1 C158.1 C159.2 C160.1 C161.1 C162.1 C163.1 C164.1 C165.1 C167.1 C169.1 C171.1 C172.2 C173.1 C174.2 C175.2 C199.1 C?.1 IC103.2(GND_1) IC103.4(GND_2) IC108.2(GND_1) IC108.4(GND_2) IC110.2(GND) IC111.2(GND) IC112.3(GND) IC113.1(GND) IC113.3(GND) IC113.4(GND) IC113.6(GND) IC114.9(GND) IC115.2(VSS) L119.1 R128.1 R132.1 R135.1 R137.1 R140.2 R142.2 R145.2 T100.6 T101.5(PRIMARY_) T103.3 Y100.1(GROUND_1) Y100.4(GROUND_2) Y101.4(GROUND_2) Y101.6(IN/OUT) Y102.1(GROUND_1) Y103.1(GROUND_1) Y103.4(GROUND_2)
2.5V_1: *100.2(OE) *100.6(VDD) C139.1 C147.2 C148.2 IC108.3(OUT) R126.1 R127.1
2.5V_2: *101.2(OE) *101.6(VDD) C146.2 C160.2 C?.2 IC103.3(OUT) R133.1 R134.1
3.0V: IC110.5(VIN) IC111.5(VIN) ; port 3.0V
3.0V_1: C144.2 C152.2 C158.2 C161.2 C164.2 C171.2 C174.1 C199.2 IC108.1(IN) IC109.7(VCC) IC111.1(VOUT) IC112.7(VCC2) IC112.8(VCC1) IC115.5(VDD) L123.1 L126.2 L131.1 L150.1 R141.1
3.0V_2: C142.2 C169.2 IC103.1(IN) IC110.3(FLAGB) IC114.2(EN) IC114.7(VCC)
IF+: IC112.1(IN+) R129.1 R130.1
IF-: IC112.2(IN-) R130.2 R131.1
LT: IC111.4(ON) ; port LT
PAEn_P: IC110.4(ON) ; port PAEn_P
TX_PWR_FWD: R144.2 ; port TX_PWR_FWD
VGA_CTRL: R148.2 ; port VGA_CTRL
Net*100_1: *100.1(NC) C140.2 R126.2 R127.2 R128.2
Net*100_4: *100.4(OUT) IC109.1(LO-)
Net*100_5: *100.5(OUT-) IC109.8(LO+)
Net*101_1: *101.1(NC) C162.2 R133.2 R134.2 R135.2
Net*101_4: *101.4(OUT) IC114.1(LO-)
Net*101_5: *101.5(OUT-) IC114.8(LO+)
NetC32_2: IC113.5(OUT) ; port ToPA
NetC141_1: C141.1 R129.2
NetC141_2: C141.2 Y100.3(OUT/IN)
NetC143_1: C143.1 C150.1 L117.2 L119.2 T100.4
NetC143_2: C143.2 C149.1 J102.1 L117.1 L118.2
NetC145_2: C145.2 Y100.2(ZC_1)
NetC149_2: C149.2 L118.1
NetC151_1: C151.1 Y101.3(OUT/IN)
NetC151_2: C151.2 R131.2
NetC153_1: C153.1 C155.2 L121.2 L150.2
NetC153_2: C153.2 Y100.6(IN/OUT)
NetC154_1: C154.1 C155.1 L122.2 L123.2
NetC154_2: C154.2 Y101.1(GROUND_1)
NetC156_2: C156.2 Y101.2(ZC_1)
NetC157_1: C157.1 L120.1 T100.1
NetC157_2: C157.2 L124.2 T100.3
NetC159_1: C159.1 T101.2(SECONDARY_CT)
NetC163_2: C163.2 L125.1 T101.4(PRIMARY_DOT)
NetC165_2: C165.2 L128.2 R137.2
NetC166_1: C166.1 C168.1 Y102.6(IN/OUT)
NetC166_2: C166.2 L126.1 L127.1
NetC167_2: C167.2 Y102.2(ZC_1)
NetC168_2: C168.2 C170.1 Y103.6(IN/OUT)
NetC170_2: C170.2 L129.1 L131.2
NetC172_1: C172.1 IC112.4(GC) R140.1 R143.1
NetC173_2: C173.2 Y103.2(ZC_1)
NetC175_1: C175.1 L133.1 R142.1
NetC212_2: T103.1 ; port Telemetry_In
NetIC109_3: IC109.3(IN+) L120.2
NetIC109_4: IC109.4(IN-) L124.1
NetIC109_5: IC109.5(OUT-) L122.1
NetIC109_6: IC109.6(OUT+) L121.1
NetIC112_5: IC112.5(OUT-) L127.2 R138.1
NetIC112_6: IC112.6(OUT+) L129.2 R138.2
NetIC113_2: IC113.2(IN) L125.2
NetIC114_3: IC114.3(IN+) L128.1 R150.2 T102.4
NetIC114_4: IC114.4(IN-) L133.2 R146.2 T102.6
NetIC114_5: IC114.5(OUT-) L132.2
NetIC114_6: IC114.6(OUT+) L130.1
NetIC115_1: IC115.1(VIN+) R141.2 R145.1
NetIC115_3: IC115.3(VIN-) R144.1 R149.2
NetIC115_4: IC115.4(VOUT) R143.2 R148.1 R149.1
NetL130_2: L130.2 T101.3(SECONDARY_DOT)
NetL132_1: L132.1 T101.1(SECONDARY)
NetR132_2: R132.2 T100.2
NetR136_1: R136.1 T102.3
NetR136_2: R136.2 Y102.3(OUT/IN)
NetR139_1: R139.1 T102.1
NetR139_2: R139.2 Y103.3(OUT/IN)
NetR146_1: R146.1 R147.1 T103.6
NetR147_2: R147.2 R150.1 T103.4

Not connected (* = marked no-connect by the designer): IC109 2(EN) 9(GND); IC110 1(VOUT); IC111 3(FLAGB); J102 2 3 4 5; T100 5; T102 2 5; T103 2 5; Y100 5(ZC_2); Y101 5(ZC_2); Y102 4(GROUND_2) 5(ZC_2); Y103 5(ZC_2)

### Notes on the sheet
- (near IC112) RF2637

### Library data of the parts
*100 *101 IC112 IC113 = Component_1
C139-C175 C199 C? = Cap: Capacitor; Published: 8-Jun-2000; LatestRevisionDate: 17-Jul-2002; LatestRevisionNote: Re-released for DXP Platform.; PackageReference: RAD-0.3; Publisher: Altium Limited; PackageDescription: Radial Cap, Thru-Hole; 2 Leads; 0.3 in Pin Spacing
IC103 IC108 = LT1963EST-2.5: Integrated Circuit; Manufacturer_Name: Linear Technology; Datasheet Link: https://www.mouser.com/datasheet/2/609/1963fc-1270290.pdf; Height: 1.8mm; Manufacturer_Part_Number: LT1963EST-2.5; Mouser Part Number: 584-LT1963EST-2.5; Mouser Price/Stock: https://www.mouser.com/Search/Refine.aspx?Keyword=584-LT1963EST-2.5
IC109 IC114 = LT5560EDD#PBF: Integrated Circuit; Manufacturer_Name: Linear Technology; Datasheet Link: https://www.analog.com/media/en/technical-documentation/data-sheets/5560f.pdf; Height: 0.8mm; Manufacturer_Part_Number: LT5560EDD#PBF; Mouser Part Number: 584-LT5560EDD#PBF; Mouser Price/Stock: https://www.mouser.com/Search/Refine.aspx?Keyword=584-LT5560EDD%23PBF; RS Part Number: 7869705; RS Price/Stock: https://uk.rs-online.com/web/p/products/7869705
IC110 = FPF2000: as IC14 on sheet Sheet1; Datasheet Link: https://www.onsemi.com/pub/Collateral/FPF2001-D.pdf; Height: 1.1mm; Manufacturer_Part_Number: FPF2000; Mouser Part Number: 512-FPF2000; Mouser Price/Stock: https://www.mouser.com/Search/Refine.aspx?Keyword=512-FPF2000; RS Part Number: 6709942P; RS Price/Stock: http://uk.rs-online.com/web/p/products/6709942P
IC111 = FPF2004: Integrated Circuit; Manufacturer_Name: ON Semiconductor; Datasheet Link: https://www.onsemi.com/pub/Collateral/FPF2001-D.pdf; Height: 1.1mm; Manufacturer_Part_Number: FPF2004; Mouser Part Number: 512-FPF2004; Mouser Price/Stock: https://www.mouser.com/Search/Refine.aspx?Keyword=512-FPF2004; RS Part Number: 8088916P; RS Price/Stock: http://uk.rs-online.com/web/p/products/8088916P
IC115 = MCP6231UT-E_LT: Integrated Circuit; Manufacturer_Name: Microchip; Manufacturer_Part_Number: MCP6231UT-E/LT; Allied_Number: 70414866; Datasheet Link: http://ww1.microchip.com/downloads/en/DeviceDoc/21881e.pdf; Height: 1.1mm; Mouser Part Number: 579-MCP6231UT-E/LT; Mouser Price/Stock: https://www.mouser.com/Search/Refine.aspx?Keyword=579-MCP6231UT-E%2FLT; RS Part Number: 7240643P; RS Price/Stock: http://uk.rs-online.com/web/p/products/7240643P; Allied Price/Stock: http://www.alliedelec.com/microchip-technology-inc-mcp6231ut-e-lt/70414866/
J102 = CONMMCX002: Connector; Manufacturer_Name: Linx Technologies; Datasheet Link: https://linxtechnologies.com/wp/wp-content/uploads/conmmcx002.pdf; Height: 3.45mm; Manufacturer_Part_Number: CONMMCX002; Mouser Part Number: 712-CONMMCX002; Mouser Price/Stock: https://www.mouser.com/Search/Refine.aspx?Keyword=712-CONMMCX002
L117-L133 L150 = Inductor: Code_IEC: 1005; Published: 8-Jun-2000; LatestRevisionDate: 29-May-2009; LatestRevisionNote: IPC-7351 Footprint Added.; PackageReference: 0402-A; Publisher: Altium Limited; PackageDescription: Chip Inductor; Code_JEITA: 0402
R126-R150 = Res1: Resistor; Published: 8-Jun-2000; LatestRevisionDate: 17-Jul-2002; LatestRevisionNote: Re-released for DXP Platform.; PackageReference: AXIAL-0.3; Publisher: Altium Limited; PackageDescription: Axial Device, Thru-Hole; 2 Leads; 0.3 in Pin Spacing
T100 = SM-LP-5001E: Transformer; Manufacturer_Name: Bourns; Allied_Number: 70155232; Datasheet Link: https://www.bourns.com/pdfs/SMLP5001.pdf; Height: 7mm; Manufacturer_Part_Number: SM-LP-5001E; Mouser Part Number: 652-SM-LP-5001E; Mouser Price/Stock: https://www.mouser.com/Search/Refine.aspx?Keyword=652-SM-LP-5001E; RS Part Number: 1728670; RS Price/Stock: https://uk.rs-online.com/web/p/products/1728670; Allied Price/Stock: https://www.alliedelec.com/bourns-sm-lp-5001e/70155232/
T101 = MABAES0061: Transformer; Manufacturer_Name: MACOM; Datasheet Link: https://componentsearchengine.com/Datasheets/1/MABAES0061.pdf; Height: 0.64mm; Manufacturer_Part_Number: MABAES0061; Mouser Part Number: 937-MABAES0061; Mouser Price/Stock: https://www.mouser.com/Search/Refine.aspx?Keyword=937-MABAES0061
T102 = WBC16-1TLC: Transformer; Manufacturer_Name: COILCRAFT; Datasheet Link: https://www.coilcraft.com/pdfs/wbc.pdf; Height: 3mm; Manufacturer_Part_Number: WBC16-1TLC; Mouser Part Number: 994-WBC16-1TLC; Mouser Price/Stock: https://www.mouser.com/Search/Refine.aspx?Keyword=994-WBC16-1TLC
T103 = WBC1-1TLB: Transformer; Manufacturer_Name: COILCRAFT; Datasheet Link: http://www.mouser.com/datasheet/2/597/wbc-463492.pdf; Height: 3mm; Manufacturer_Part_Number: WBC1-1TLB; Mouser Part Number: 994-WBC1-1TLB; Mouser Price/Stock: https://www.mouser.co.uk/ProductDetail/Coilcraft/WBC1-1TLB?qs=ZYnrCdKdyefPGG%252BYZVKz5Q%3D%3D
Y100-Y103 = ECS-75SMF45A30B: Crystal or Oscillator; Manufacturer_Name: ECS; Datasheet Link: https://www.mouser.com/datasheet/2/122/ECS_75SMF-10007.pdf; Height: 0.95mm; Manufacturer_Part_Number: ECS-75SMF45A30B; Mouser Part Number: 520-ECS-75SMF45A30B; Mouser Price/Stock: https://www.mouser.com/Search/Refine.aspx?Keyword=520-ECS-75SMF45A30B

## Sheet RXTX4.SchDoc
size A
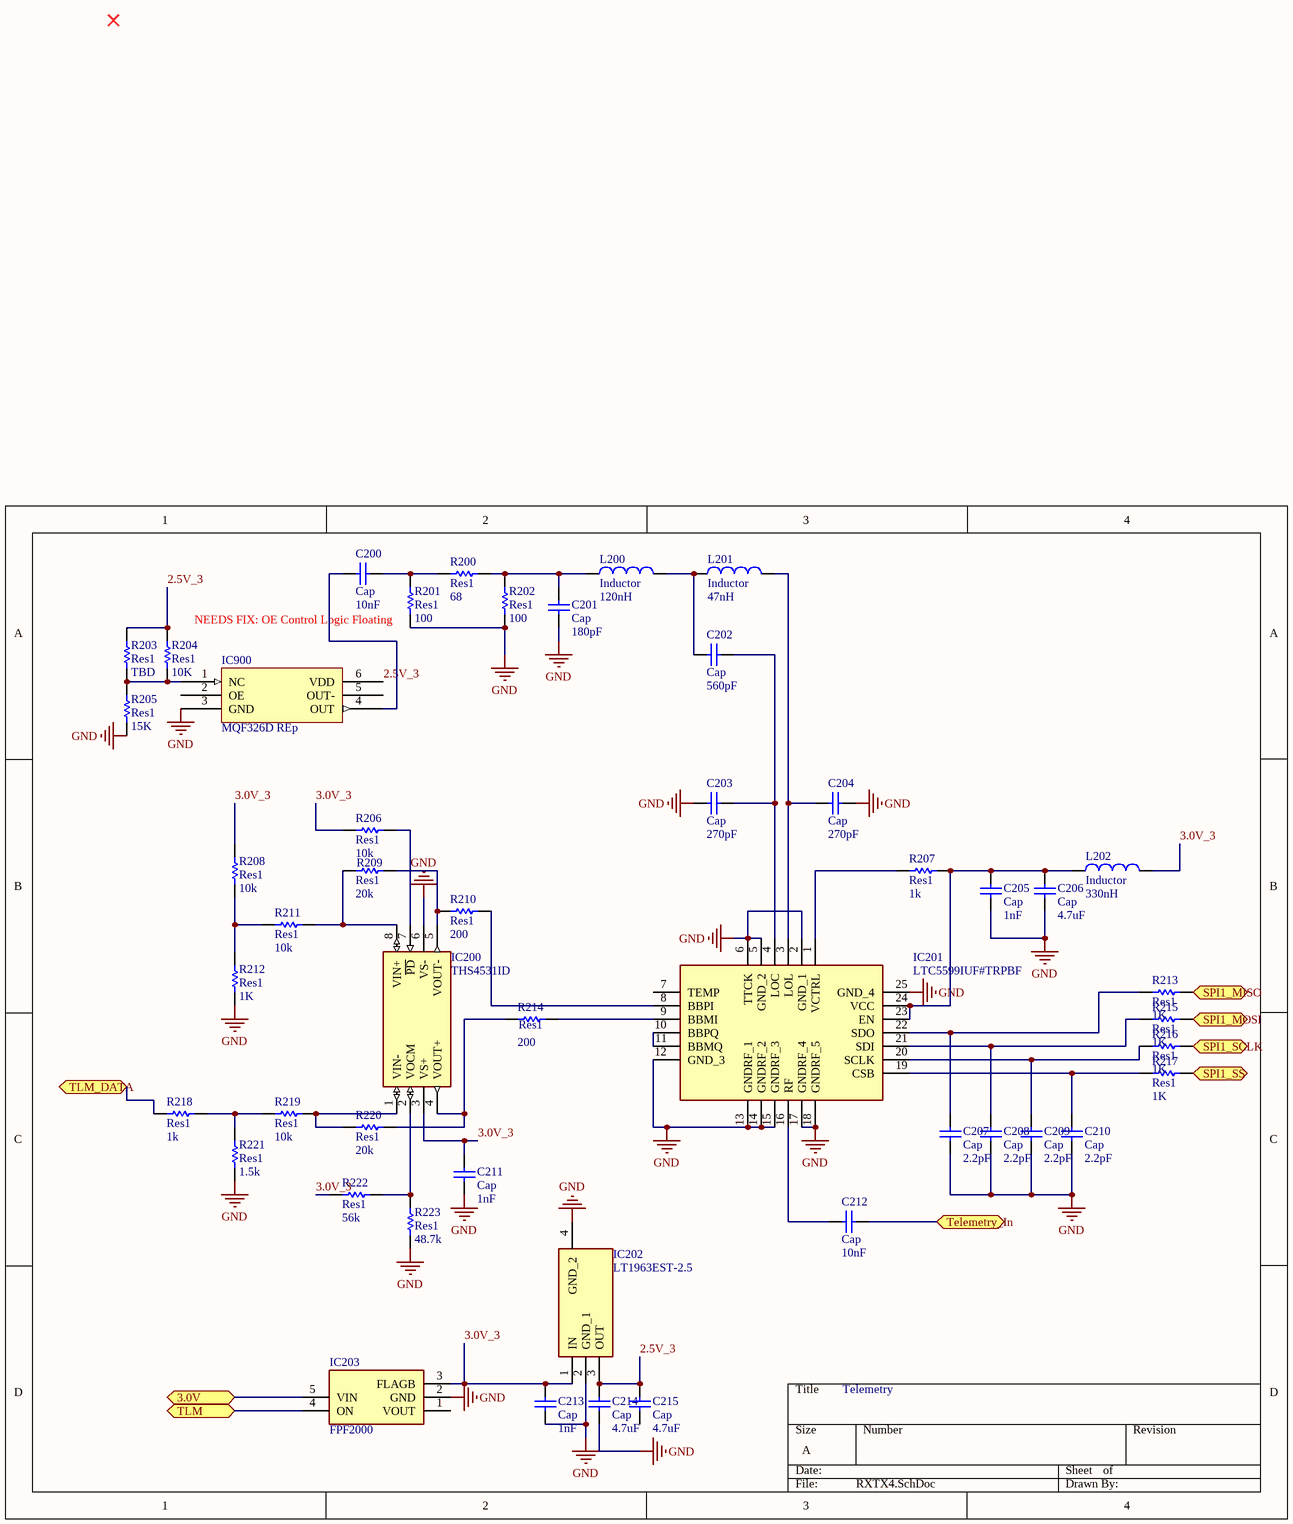
[diagram p3: RXTX4.SchDoc]

### Parts
C200  Cap  value 10nF  [0603]
C201  Cap  value 180pF  [0603]
C202  Cap  value 560pF  [0603]
C203  Cap  value 270pF  [0603]
C204  Cap  value 270pF  [0603]
C205  Cap  value 1nF  [0603]
C206  Cap  value 4.7uF  [0603]
C207  Cap  value 2.2pF  [0603]
C208  Cap  value 2.2pF  [0603]
C209  Cap  value 2.2pF  [0603]
C210  Cap  value 2.2pF  [0603]
C211  Cap  value 1nF  [0603]
C212  Cap  value 10nF  [0603]
C213  Cap  value 1nF  [0603]
C214  Cap  value 4.7uF  [0603]
C215  Cap  value 4.7uF  [0603]
IC200  THS4531ID  [SOIC127P600X175-8N]
IC201  LTC5599IUF#TRPBF  [QFN50P400X400X80-25N-D]
IC202  LT1963EST-2.5  [SOT230P700X180-4N]
IC203  FPF2000  [SOT65P210X110-5N]
IC900  MQF326D REp  [MQF326D]
L200  Inductor  value 120nH  [0603]
L201  Inductor  value 47nH  [0603]
L202  Inductor  value 330nH  [0603]
R200  Res1  value 68  [0603]
R201  Res1  value 100  [0603]
R202  Res1  value 100  [0603]
R203  Res1  value TBD  [0603]
R204  Res1  value 10K  [0603]
R205  Res1  value 15K  [0603]
R206  Res1  value 10k  [0603]
R207  Res1  value 1k  [0603]
R208  Res1  value 10k  [0603]
R209  Res1  value 20k  [0603]
R210  Res1  value 200  [0603]
R211  Res1  value 10k  [0603]
R212  Res1  value 1K  [0603]
R213  Res1  value 1K  [0603]
R214  Res1  value 200  [0603]
R215  Res1  value 1K  [0603]
R216  Res1  value 1K  [0603]
R217  Res1  value 1K  [0603]
R218  Res1  value 1k  [0603]
R219  Res1  value 10k  [0603]
R220  Res1  value 20k  [0603]
R221  Res1  value 1.5k  [0603]
R222  Res1  value 56k  [0603]
R223  Res1  value 48.7k  [0603]

### Ports
3.0V (bidir), SPI1_MISO (bidir), SPI1_MOSI (bidir), SPI1_SCLK (bidir), SPI1_SS (bidir), Telemetry_In (bidir), TLM (bidir), TLM_DATA (bidir)

### Nets
GND: C201.1 C203.2 C204.1 C205.2 C206.2 C207.2 C208.2 C209.2 C210.2 C211.2 C213.2 C214.2 IC200.6(VS-) IC201.2(GND_1) IC201.5(GND_2) IC201.6(TTCK) IC201.12(GND_3) IC201.13(GNDRF_1) IC201.14(GNDRF_2) IC201.15(GNDRF_3) IC201.17(GNDRF_4) IC201.18(GNDRF_5) IC201.25(GND_4) IC202.2(GND_1) IC202.4(GND_2) IC203.2(GND) IC900.3(GND) R201.1 R202.2 R205.1 R212.2 R221.1 R223.1
2.5V_3: C214.1 C215.1 IC202.3(OUT) IC900.6(VDD) R203.2 R204.2
3.0V: IC203.5(VIN) ; port 3.0V
3.0V_3: C211.1 C213.1 IC200.3(VS+) IC202.1(IN) IC203.3(FLAGB) L202.2 R206.1 R208.1 R222.1
SPI1_MISO: R213.2 ; port SPI1_MISO
SPI1_MOSI: R215.2 ; port SPI1_MOSI
SPI1_SCLK: R216.2 ; port SPI1_SCLK
SPI1_SS: R217.2 ; port SPI1_SS
TLM: IC203.4(ON) ; port TLM
TLM_DATA: R218.1 ; port TLM_DATA
NetC200_1: C200.1 IC900.4(OUT)
NetC200_2: C200.2 R200.2 R201.2
NetC201_2: C201.2 L200.1 R200.1 R202.1
NetC202_1: C202.1 C203.1 IC201.4(LOC)
NetC202_2: C202.2 L200.2 L201.1
NetC204_2: C204.2 IC201.3(LOL) L201.2
NetC205_1: C205.1 C206.1 IC201.23(EN) IC201.24(VCC) L202.1 R207.1
NetC207_1: C207.1 IC201.22(SDO) R213.1
NetC208_1: C208.1 IC201.21(SDI) R215.1
NetC209_1: C209.1 IC201.20(SCLK) R216.1
NetC210_1: C210.1 IC201.19(CSB) R217.1
NetC212_1: C212.1 IC201.16(RF)
NetC212_2: C212.2 ; port Telemetry_In
NetIC200_1: IC200.1(VIN-) R219.2 R220.1
NetIC200_2: IC200.2(VOCM) R222.2 R223.2
NetIC200_4: IC200.4(VOUT+) R214.1 R220.2
NetIC200_5: IC200.5(VOUT-) R209.2 R210.1
NetIC200_7: IC200.7(~{PD}) R206.2
NetIC200_8: IC200.8(VIN+) R209.1 R211.2
NetIC201_1: IC201.1(VCTRL) R207.2
NetIC201_8: IC201.8(BBPI) R210.2
NetIC201_9: IC201.9(BBMI) R214.2
NetIC201_10: IC201.10(BBPQ) IC201.11(BBMQ)
NetIC900_1: IC900.1(NC) R203.1 R204.1 R205.2
NetR208_2: R208.2 R211.1 R212.1
NetR218_2: R218.2 R219.1 R221.2

Not connected (* = marked no-connect by the designer): C215 2; IC201 7(TEMP); IC203 1(VOUT); IC900 2(OE) 5(OUT-)

### Notes on the sheet
- (near R201) NEEDS FIX: OE Control Logic Floating
- Telemetry

### Library data of the parts
C200-C215 = Cap: Capacitor; Published: 8-Jun-2000; LatestRevisionDate: 17-Jul-2002; LatestRevisionNote: Re-released for DXP Platform.; PackageReference: RAD-0.3; Publisher: Altium Limited; PackageDescription: Radial Cap, Thru-Hole; 2 Leads; 0.3 in Pin Spacing
IC200 = THS4531ID: Integrated Circuit; Manufacturer_Name: Texas Instruments; Datasheet Link: http://www.ti.com/lit/gpn/ths4531; Height: 1.75mm; Manufacturer_Part_Number: THS4531ID; Mouser Part Number: 595-THS4531ID; Mouser Price/Stock: https://www.mouser.com/Search/Refine.aspx?Keyword=595-THS4531ID; RS Part Number: 7741408P; RS Price/Stock: http://uk.rs-online.com/web/p/products/7741408P
IC201 = LTC5599IUF#TRPBF: Integrated Circuit; Manufacturer_Name: Linear Technology; Datasheet Link: http://www.linear.com/docs/45277; Height: 0.8mm; Manufacturer_Part_Number: LTC5599IUF#TRPBF; Mouser Part Number: 584-LTC5599IUF#TRPBF; Mouser Price/Stock: https://www.mouser.com/Search/Refine.aspx?Keyword=584-LTC5599IUF%23TRPBF
IC202 = LT1963EST-2.5: as IC103 on sheet RXTX4F; Datasheet Link: https://www.mouser.com/datasheet/2/609/1963fc-1270290.pdf; Height: 1.8mm; Manufacturer_Part_Number: LT1963EST-2.5; Mouser Part Number: 584-LT1963EST-2.5; Mouser Price/Stock: https://www.mouser.com/Search/Refine.aspx?Keyword=584-LT1963EST-2.5
IC203 = FPF2000: as IC14 on sheet Sheet1; Datasheet Link: https://www.onsemi.com/pub/Collateral/FPF2001-D.pdf; Height: 1.1mm; Manufacturer_Part_Number: FPF2000; Mouser Part Number: 512-FPF2000; Mouser Price/Stock: https://www.mouser.com/Search/Refine.aspx?Keyword=512-FPF2000; RS Part Number: 6709942P; RS Price/Stock: http://uk.rs-online.com/web/p/products/6709942P
IC900 = Component_1
L200-L202 = Inductor: Code_IEC: 1005; Published: 8-Jun-2000; LatestRevisionDate: 29-May-2009; LatestRevisionNote: IPC-7351 Footprint Added.; PackageReference: 0402-A; Publisher: Altium Limited; PackageDescription: Chip Inductor; Code_JEITA: 0402
R200-R223 = Res1: Resistor; Published: 8-Jun-2000; LatestRevisionDate: 17-Jul-2002; LatestRevisionNote: Re-released for DXP Platform.; PackageReference: AXIAL-0.3; Publisher: Altium Limited; PackageDescription: Axial Device, Thru-Hole; 2 Leads; 0.3 in Pin Spacing

## Nets that join several sheets
GND: Sheet1 (48 pins), Sheet2 (68 pins), RXTX4F (61 pins), RXTX4 (33 pins)
3.0V: Sheet1 (C67.2 C69.2 IC18.1 R41.1), Sheet2 (IC6.5), RXTX4F (IC110.5 IC111.5), RXTX4 (IC203.5)
LT: Sheet1 (IC12.4), RXTX4F (IC111.4)
NetC32_2: Sheet2 (C32.2), RXTX4F (IC113.5)
NetC212_2: RXTX4F (T103.1), RXTX4 (C212.2)
PAEn_P: Sheet1 (IC11.11 IC12.11 IC12.12), Sheet2 (IC6.4 IC10.5), RXTX4F (IC110.4)
SPI1_MISO: Sheet1 (J2.3), RXTX4 (R213.2)
SPI1_MOSI: Sheet1 (J2.4), RXTX4 (R215.2)
SPI1_SCLK: Sheet1 (J2.2), RXTX4 (R216.2)
SPI1_SS: Sheet1 (J2.46), RXTX4 (R217.2)
TLM: Sheet1 (IC12.1), RXTX4 (IC203.4)
TLM_DATA: Sheet1 (J2.38), RXTX4 (R218.1)
TX_PWR_FWD: Sheet1 (J2.48), Sheet2 (R21.2), RXTX4F (R144.2)
TX_PWR_RFLT: Sheet1 (J2.58), Sheet2 (IC5.5)
Vbatt: Sheet1 (10 pins), Sheet2 (C48.1 C49.1 IC10.8)
VGA_CTRL: Sheet1 (J2.36), RXTX4F (R148.2)
VPA: Sheet1 (C66.1 IC16.5 R39.2), Sheet2 (9 pins)